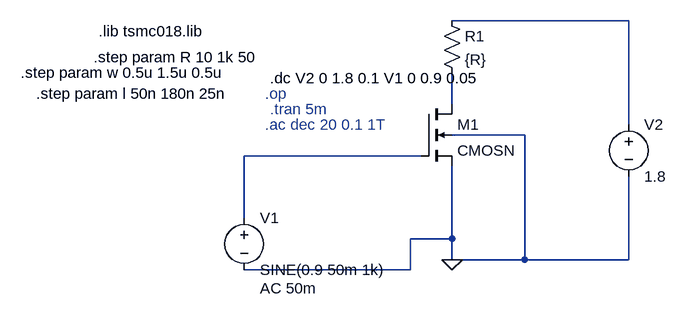
[diagram p0: schematic assignment01.asc]
assignment01.asc, the LTspice schematic file:
Version 4
SHEET 1 880 680
WIRE 752 48 480 48
WIRE 480 176 480 128
WIRE 752 208 752 48
WIRE 592 224 480 224
WIRE 432 256 160 256
WIRE 160 352 160 256
WIRE 480 384 480 272
WIRE 480 384 416 384
WIRE 480 416 480 384
WIRE 592 416 592 224
WIRE 592 416 480 416
WIRE 752 416 752 288
WIRE 752 416 592 416
WIRE 416 432 416 384
WIRE 416 432 160 432
FLAG 480 416 0
SYMBOL voltage 160 336 R0
WINDOW 123 24 124 Left 2
WINDOW 39 0 0 Left 0
SYMATTR InstName V1
SYMATTR Value SINE(0.9 50m 1k)
SYMATTR Value2 AC 50m
SYMBOL voltage 752 192 R0
WINDOW 123 0 0 Left 0
WINDOW 39 0 0 Left 0
SYMATTR InstName V2
SYMATTR Value 1.8
SYMBOL nmos4 432 176 R0
SYMATTR InstName M1
SYMATTR Value CMOSN
SYMATTR Value2 l={l} w={w}
SYMBOL res 464 32 R0
SYMATTR InstName R1
SYMATTR Value {R}
TEXT -64 64 Left 2 !.lib tsmc018.lib
TEXT 192 160 Left 2 ;.op
TEXT 200 184 Left 2 ;.tran 5m
TEXT 192 208 Left 2 ;.ac dec 20 0.1 1T
TEXT 200 136 Left 2 !.dc V2 0 1.8 0.1 V1 0 0.9 0.05
TEXT -72 104 Left 2 !.step param R 10 1k 50
TEXT -184 128 Left 2 !.step param w 0.5u 1.5u 0.5u
TEXT -160 160 Left 2 !.step param l 50n 180n 25n

The netlist it stands for:
* assignment01.asc
V1 N003 0 SINE(0.9 50m 1k) AC 50m
V2 N001 0 1.8
M1 N002 N003 0 0 CMOSN l={l} w={w}
R1 N001 N002 {R}
.model NMOS NMOS
.model PMOS PMOS
.lib standard.mos
.lib tsmc018.lib
* .op
* .tran 5m
* .ac dec 20 0.1 1T
.dc V2 0 1.8 0.1 V1 0 0.9 0.05
.step param R 10 1k 50
.step param w 0.5u 1.5u 0.5u
.step param l 50n 180n 25n
.backanno
.end